# Altium schematic sheet Connectors.SchDoc
size A2; SheetNumber: 27; SheetTotal: 29
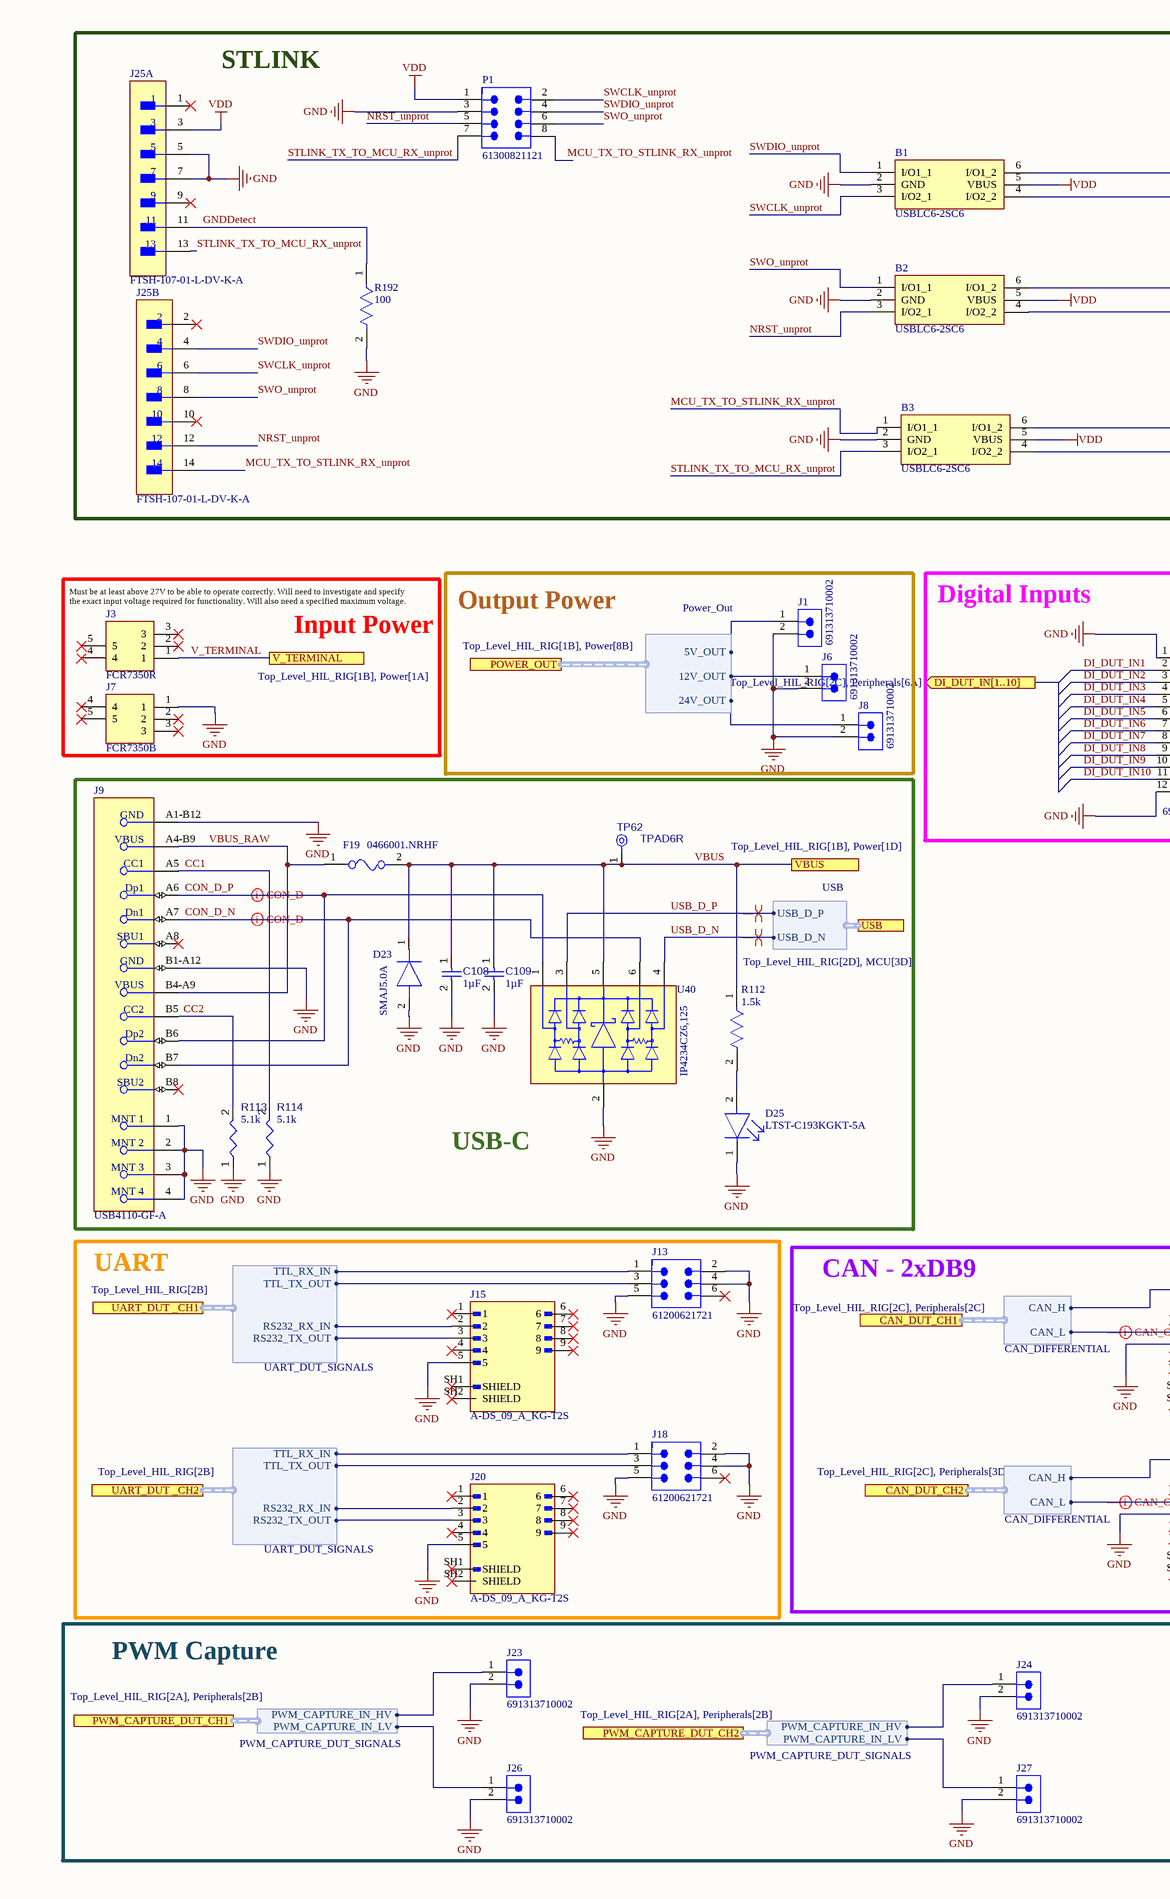
[diagram p0: Connectors.SchDoc, left]
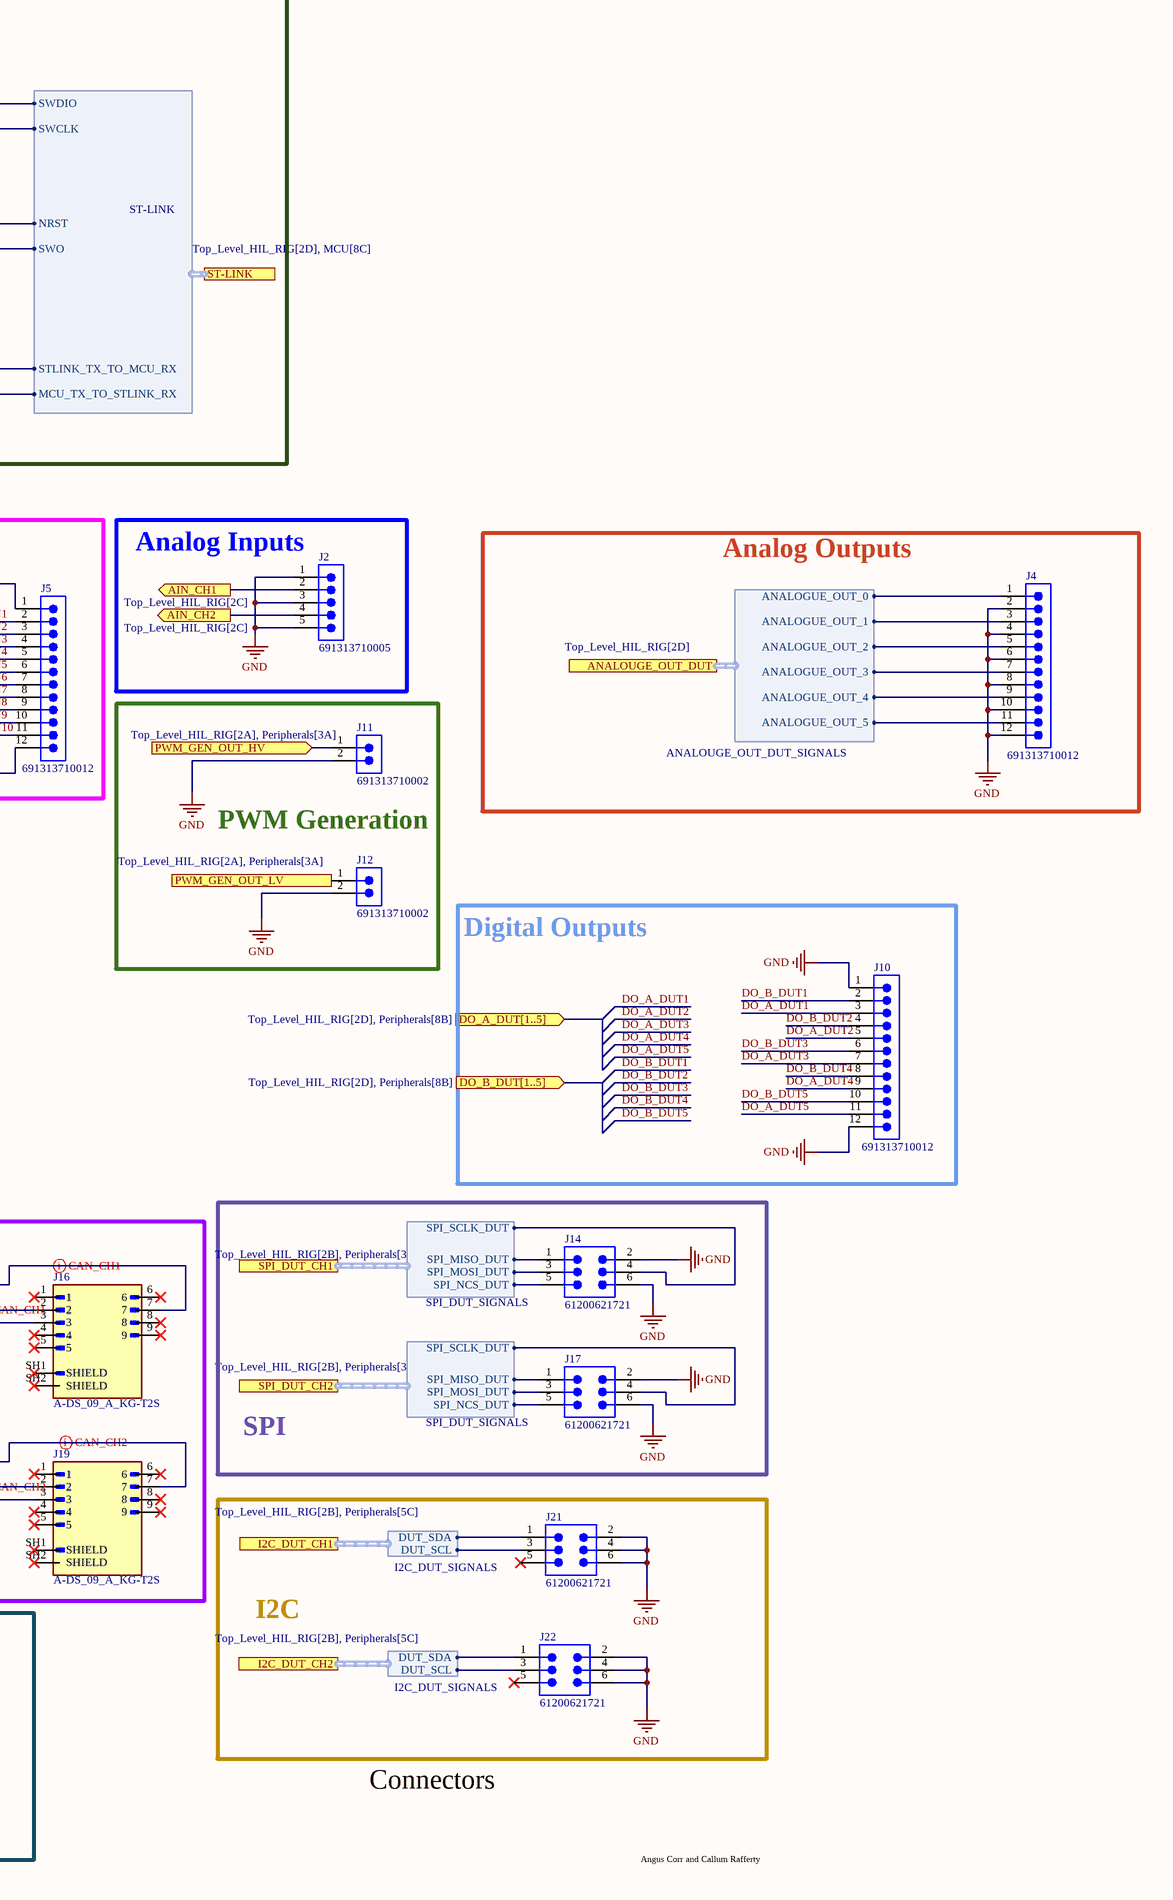
[diagram p1: Connectors.SchDoc, right]

## Parts
B1  USBLC6-2SC6  [SOT95P280X145-6N]
B2  USBLC6-2SC6  [SOT95P280X145-6N]
B3  USBLC6-2SC6  [SOT95P280X145-6N]
C108  value 1µF  [CAPC1608X90X40LL10T20]  (hidden comment: Capacitor 1 uF +/- 10% 25 V 0603)
C109  value 1µF  [CAPC1608X90X40LL10T20]  (hidden comment: Capacitor 1 uF +/- 10% 25 V 0603)
D23  SMAJ5.0A  [DIOM5026X229N]
D25  LTST-C193KGKT-5A  [FP-LTST-C193KGKT-5A-MFG]
F19  0466001.NRHF  [FP-0466-MFG]
J1  691313710002  [691313710002]
J2  691313710005  [691313710005]
J3  FCR7350R  [FCR7350R]
J4  691313710012  [691313710012]
J5  691313710012  [691313710012]
J6  691313710002  [691313710002]
J7  FCR7350B  [FCR7350B]
J8  691313710002  [691313710002]
J9  USB4110-GF-A  [FP-USB4110-GF-A-MFG]
J10  691313710012  [691313710012]
J11  691313710002  [691313710002]
J12  691313710002  [691313710002]
J13  61200621721  [61200621721]
J14  61200621721  [61200621721]
J15  A-DS_09_A_KG-T2S  [ASSMANN_A-DS_09_A_KG-T2S]
J16  A-DS_09_A_KG-T2S  [ASSMANN_A-DS_09_A_KG-T2S]
J17  61200621721  [61200621721]
J18  61200621721  [61200621721]
J19  A-DS_09_A_KG-T2S  [ASSMANN_A-DS_09_A_KG-T2S]
J20  A-DS_09_A_KG-T2S  [ASSMANN_A-DS_09_A_KG-T2S]
J21  61200621721  [61200621721]
J22  61200621721  [61200621721]
J23  691313710002  [691313710002]
J24  691313710002  [691313710002]
J25  FTSH-107-01-L-DV-K-A  [FP-FTSH-107-01-L-DV-K-A-MFG]  (parts A,B of 2)
J26  691313710002  [691313710002]
J27  691313710002  [691313710002]
P1  61300821121  [61300821121]
R112  value 1.5k  [FP-RT0603-IPC_C]  (hidden comment: RT0603BRD071K5L)
R113  value 5.1k  [FP-AC0603-IPC_C]  (hidden comment: AC0603FR-075K1L)
R114  value 5.1k  [FP-AC0603-IPC_C]  (hidden comment: AC0603FR-075K1L)
R192  value 100  [FP-RT0603-IPC_C]  (hidden comment: RT0603BRD07100RL)
TP62  TPAD6R  [TP06R]  (no BOM)
U40  IP4234CZ6,125  [Nexperia_SOT457_IPC_C]

## Blocks framed on the sheet
STLINK: B1-B3 J25 P1 R192
Input Power: J3 J7
Output Power: J1 J6 J8
Digital Inputs: J5
Analog Inputs: J2
Analog Outputs: J4
PWM Generation: J11 J12
USB-C: C108 C109 D23 D25 F19 J9 R112-R114 TP62 U40
Digital Outputs: J10
SPI: J14 J17
UART: J13 J15 J18 J20
CAN - 2xDB9: J16 J19
I2C: J21 J22
PWM Capture: J23 J24 J26 J27

## Ports
AIN_CH1 (out, see Top_Level_HIL_RIG[2C]), AIN_CH2 (out, see Top_Level_HIL_RIG[2C]), ANALOUGE_OUT_DUT (harness ANALOUGE_OUT_DUT_SIGNALS, see Top_Level_HIL_RIG[2D]), CAN_DUT_CH1 (harness CAN_DIFFERENTIAL, see Top_Level_HIL_RIG[2C], Peripherals[2C]), CAN_DUT_CH2 (harness CAN_DIFFERENTIAL, see Top_Level_HIL_RIG[2C], Peripherals[3D]), DI_DUT_IN[1..10] (out, see Top_Level_HIL_RIG[2C], Peripherals[6A]), DO_A_DUT[1..5] (in, see Top_Level_HIL_RIG[2D], Peripherals[8B]), DO_B_DUT[1..5] (in, see Top_Level_HIL_RIG[2D], Peripherals[8B]), I2C_DUT_CH1 (harness I2C_DUT_SIGNALS, see Top_Level_HIL_RIG[2B], Peripherals[5C]), I2C_DUT_CH2 (harness I2C_DUT_SIGNALS, see Top_Level_HIL_RIG[2B], Peripherals[5C]), POWER_OUT (harness Power_Out, see Top_Level_HIL_RIG[1B], Power[8B]), PWM_CAPTURE_DUT_CH1 (harness PWM_CAPTURE_DUT_SIGNALS, see Top_Level_HIL_RIG[2A], Peripherals[2B]), PWM_CAPTURE_DUT_CH2 (harness PWM_CAPTURE_DUT_SIGNALS, see Top_Level_HIL_RIG[2A], Peripherals[2B]), PWM_GEN_OUT_HV (in, see Top_Level_HIL_RIG[2A], Peripherals[3A]), PWM_GEN_OUT_LV (in, see Top_Level_HIL_RIG[2A], Peripherals[3A]), SPI_DUT_CH1 (harness SPI_DUT_SIGNALS, see Top_Level_HIL_RIG[2B], Peripherals[3C]), SPI_DUT_CH2 (harness SPI_DUT_SIGNALS, see Top_Level_HIL_RIG[2B], Peripherals[3C]), ST-LINK (harness ST-LINK, see Top_Level_HIL_RIG[2D], MCU[8C]), UART_DUT _CH1 (harness UART_DUT_SIGNALS, see Top_Level_HIL_RIG[2B]), UART_DUT _CH2 (harness UART_DUT_SIGNALS, see Top_Level_HIL_RIG[2B]), USB (harness USB, see Top_Level_HIL_RIG[2D], MCU[3D]), V_TERMINAL (see Top_Level_HIL_RIG[1B], Power[1A]), VBUS (see Top_Level_HIL_RIG[1B], Power[1D])

## Harnesses
USB: USB_D_P, USB_D_N
Power_Out: 24V_OUT, 12V_OUT, 5V_OUT
UART_DUT_SIGNALS: RS232_RX_IN, RS232_TX_OUT, TTL_RX_IN, TTL_TX_OUT
CAN_DIFFERENTIAL: CAN_H, CAN_L
PWM_CAPTURE_DUT_SIGNALS: PWM_CAPTURE_IN_HV, PWM_CAPTURE_IN_LV
I2C_DUT_SIGNALS: DUT_SCL, DUT_SDA
SPI_DUT_SIGNALS: SPI_MISO_DUT, SPI_MOSI_DUT, SPI_NCS_DUT, SPI_SCLK_DUT
ST-LINK: STLINK_TX_TO_MCU_RX, MCU_TX_TO_STLINK_RX, SWO, NRST, SWCLK, SWDIO
ANALOUGE_OUT_DUT_SIGNALS: ANALOGUE_OUT_0, ANALOGUE_OUT_1, ANALOGUE_OUT_2, ANALOGUE_OUT_3, ANALOGUE_OUT_4, ANALOGUE_OUT_5

## Nets
GND: B1.2(GND) B2.2(GND) B3.2(GND) C108.2 C109.2 D23.2(A) D25.1(C) J1.2 J2.1 J2.3 J2.5 J4.2 J4.4 J4.6 J4.8 J4.10 J4.12 J5.1 J5.12 J6.2 J7.1 J8.2 J9.1(MNT_1) J9.2(MNT_2) J9.3(MNT_3) J9.4(MNT_4) J9.A1-B12(GND) J9.B1-A12(GND) J10.1 J10.12 J11.2 J12.2 J13.2 J13.4 J13.5 J14.2 J14.6 J15.5 J16.3 J17.2 J17.6 J18.2 J18.4 J18.5 J19.3 J20.5 J21.2 J21.4 J21.6 J22.2 J22.4 J22.6 J23.2 J24.2 J25.5 J25.7 J26.2 J27.2 P1.3 R113.1 R114.1 R192.2 U40.2
VDD: B1.5(VBUS) B2.5(VBUS) B3.5(VBUS) J25.3 P1.1
AIN_CH1: J2.2 ; port AIN_CH1
AIN_CH2: J2.4 ; port AIN_CH2
CC1: J9.A5(CC1) R114.2
CC2: J9.B5(CC2) R113.2
CON_D_N: J9.A7(Dn1) J9.B7(Dn2) U40.6
CON_D_P: J9.A6(Dp1) J9.B6(Dp2) U40.1
DI_DUT_IN1: J5.2
DI_DUT_IN2: J5.3
DI_DUT_IN3: J5.4
DI_DUT_IN4: J5.5
DI_DUT_IN5: J5.6
DI_DUT_IN6: J5.7
DI_DUT_IN7: J5.8
DI_DUT_IN8: J5.9
DI_DUT_IN9: J5.10
DI_DUT_IN10: J5.11
DO_A_DUT1: J10.3
DO_A_DUT2: J10.5
DO_A_DUT3: J10.7
DO_A_DUT4: J10.9
DO_A_DUT5: J10.11
DO_B_DUT1: J10.2
DO_B_DUT2: J10.4
DO_B_DUT3: J10.6
DO_B_DUT4: J10.8
DO_B_DUT5: J10.10
GNDDetect: J25.11 R192.1
MCU_TX_TO_STLINK_RX_unprot: B3.1(I/O1_1) J25.14 P1.8
NRST_unprot: B2.3(I/O2_1) J25.12 P1.5
PWM_GEN_OUT_HV: J11.1 ; port PWM_GEN_OUT_HV
PWM_GEN_OUT_LV: J12.1 ; port PWM_GEN_OUT_LV
STLINK_TX_TO_MCU_RX_unprot: B3.3(I/O2_1) J25.13 P1.7
SWCLK_unprot: B1.3(I/O2_1) J25.6 P1.2
SWDIO_unprot: B1.1(I/O1_1) J25.4 P1.4
SWO_unprot: B2.1(I/O1_1) J25.8 P1.6
USB_D_N: U40.4 ; port USB.USB_D_N
USB_D_P: U40.3 ; port USB.USB_D_P
V_TERMINAL: J3.1 ; port V_TERMINAL
VBUS: C108.1 C109.1 D23.1(K) F19.2 R112.1 TP62.1(TP) U40.5 ; port VBUS
VBUS_RAW: F19.1 J9.A4-B9(VBUS) J9.B4-A9(VBUS)
NetB1_4: B1.4(I/O2_2) ; port ST-LINK.SWCLK
NetB1_6: B1.6(I/O1_2) ; port ST-LINK.SWDIO
NetB2_4: B2.4(I/O2_2) ; port ST-LINK.SWO
NetB2_6: B2.6(I/O1_2) ; port ST-LINK.NRST
NetB3_4: B3.4(I/O2_2) ; port ST-LINK.MCU_TX_TO_STLINK_RX
NetB3_6: B3.6(I/O1_2) ; port ST-LINK.STLINK_TX_TO_MCU_RX
NetD25_2: D25.2(A) R112.2
NetJ1_1: J1.1 ; port POWER_OUT.5V_OUT
NetJ4_1: J4.1 ; port ANALOUGE_OUT_DUT.ANALOGUE_OUT_0
NetJ4_3: J4.3 ; port ANALOUGE_OUT_DUT.ANALOGUE_OUT_1
NetJ4_5: J4.5 ; port ANALOUGE_OUT_DUT.ANALOGUE_OUT_2
NetJ4_7: J4.7 ; port ANALOUGE_OUT_DUT.ANALOGUE_OUT_3
NetJ4_9: J4.9 ; port ANALOUGE_OUT_DUT.ANALOGUE_OUT_4
NetJ4_11: J4.11 ; port ANALOUGE_OUT_DUT.ANALOGUE_OUT_5
NetJ6_1: J6.1 ; port POWER_OUT.12V_OUT
NetJ8_1: J8.1 ; port POWER_OUT.24V_OUT
NetJ13_1: J13.1 ; port UART_DUT _CH1.TTL_RX_IN
NetJ13_3: J13.3 ; port UART_DUT _CH1.TTL_TX_OUT
NetJ14_1: J14.1 ; port SPI_DUT_CH1.SPI_MISO_DUT
NetJ14_3: J14.3 ; port SPI_DUT_CH1.SPI_MOSI_DUT
NetJ14_4: J14.4 ; port SPI_DUT_CH1.SPI_SCLK_DUT
NetJ14_5: J14.5 ; port SPI_DUT_CH1.SPI_NCS_DUT
NetJ15_2: J15.2 ; port UART_DUT _CH1.RS232_RX_IN
NetJ15_3: J15.3 ; port UART_DUT _CH1.RS232_TX_OUT
NetJ16_2: J16.2 ; port CAN_DUT_CH1.CAN_L
NetJ16_7: J16.7 ; port CAN_DUT_CH1.CAN_H
NetJ17_1: J17.1 ; port SPI_DUT_CH2.SPI_MISO_DUT
NetJ17_3: J17.3 ; port SPI_DUT_CH2.SPI_MOSI_DUT
NetJ17_4: J17.4 ; port SPI_DUT_CH2.SPI_SCLK_DUT
NetJ17_5: J17.5 ; port SPI_DUT_CH2.SPI_NCS_DUT
NetJ18_1: J18.1 ; port UART_DUT _CH2.TTL_RX_IN
NetJ18_3: J18.3 ; port UART_DUT _CH2.TTL_TX_OUT
NetJ19_2: J19.2 ; port CAN_DUT_CH2.CAN_L
NetJ19_7: J19.7 ; port CAN_DUT_CH2.CAN_H
NetJ20_2: J20.2 ; port UART_DUT _CH2.RS232_RX_IN
NetJ20_3: J20.3 ; port UART_DUT _CH2.RS232_TX_OUT
NetJ21_1: J21.1 ; port I2C_DUT_CH1.DUT_SDA
NetJ21_3: J21.3 ; port I2C_DUT_CH1.DUT_SCL
NetJ22_1: J22.1 ; port I2C_DUT_CH2.DUT_SDA
NetJ22_3: J22.3 ; port I2C_DUT_CH2.DUT_SCL
NetJ23_1: J23.1 ; port PWM_CAPTURE_DUT_CH1.PWM_CAPTURE_IN_HV
NetJ24_1: J24.1 ; port PWM_CAPTURE_DUT_CH2.PWM_CAPTURE_IN_HV
NetJ26_1: J26.1 ; port PWM_CAPTURE_DUT_CH1.PWM_CAPTURE_IN_LV
NetJ27_1: J27.1 ; port PWM_CAPTURE_DUT_CH2.PWM_CAPTURE_IN_LV

Not connected (* = marked no-connect by the designer): J3 2* 3* 4* 5*; J7 2* 3* 4* 5*; J9 A8(SBU1)* B8(SBU2)*; J13 6*; J15 1* 4* 6* 7* 8* 9* SH1(SHIELD)* SH2(SHIELD)*; J16 1* 4* 5* 6* 8* 9* SH1(SHIELD)* SH2(SHIELD)*; J18 6*; J19 1* 4* 5* 6* 8* 9* SH1(SHIELD)* SH2(SHIELD)*; J20 1* 4* 6* 7* 8* 9* SH1(SHIELD)* SH2(SHIELD)*; J21 5*; J22 5*; J25 1* 2* 9* 10*

## Layout directives
differential pair; differential pair class USB_DIFF_PAIR: CON_D_P
differential pair: CON_D_N, NetJ16_7, NetJ19_7, USB_D_N, USB_D_P
differential pair; differential pair class CAN_DIFF_PAIR: NetJ16_2, NetJ19_2

## Notes on the sheet
- (near J3) Must be at least above 27V to be able to operate correctly. Will need to investigate and specify the exact input voltage required for functionality. Will also need a specified maximum voltage.
- Connectors
- Angus Corr and Callum Rafferty

## Library data of the parts
B1-B3 = CMP-004-00066-1: TVS Diode Array Uni-Directional USBLC6-2SC6 17V, SOT-23 6-Pin; Manufacturer_Name: STMicroelectronics; Geometry.Height: 1.45mm; Arrow Price/Stock: https://www.arrow.com/en/products/usblc6-2sc6/stmicroelectronics.html?utm_currency=USD&region=nac; Manufacturer_Part_Number: USBLC6-2SC6; Arrow Part Number: USBLC6-2SC6; Datasheet Link: https://www.st.com/resource/en/datasheet/usblc6-2.pdf; Mouser Part Number: 511-USBLC6-2SC6; Source: USBLC6-2SC6.SchLib; Design Item ID: USBLC6-2SC6; Mouser Price/Stock: https://www.mouser.co.uk/ProductDetail/STMicroelectronics/USBLC6-2SC6?qs=po45yt2pPpu%2FhNIlwQdTlg%3D%3D
C108 C109 = CMP-001-00005-6: Chip Capacitor, 1 uF, +/- 10%, 25 V, 0603 (1608 Metric); Capacitor Type: Ceramic; Voltage Rating: 25V; Pins: 2; Mounting Technology: SM; RoHS Compliant: True; Max Operating Temperature: 125°C; Case/Package: 0603; Min Operating Temperature: -55°C; Tolerance: 10%
D23 = CMP-004-00080-1: BOURNS - SMAJ5.0A - TVS Diode; Manufacturer_Name: Bourns; Source: MAX17643ATC+.SchLib; Datasheet Link: https://detail.tmall.com/item.htm?id=548354020241&ali_refid=a3_430583_1006:1109983619:N:3Uw9kZ3UMDT/QL57nh1fXA==:ab063b49c94624768a940a913313feb0&ali_trackid=1_ab063b49c94624768a940a913313feb0&spm=a230r.1.14.1; Arrow Price/Stock: https://www.arrow.com/en/products/smaj5-0a_21/bourns.html?utm_currency=USD&region=nac; Mouser Price/Stock: https://www.mouser.co.uk/ProductDetail/Bourns/SMAJ5.0A?qs=A3H9pljuJ8RbLIvzFxDfUA%3D%3D; Height: 2.29mm; Arrow Part Number: SMAJ5.0A; Manufacturer_Part_Number: SMAJ5.0A; Mouser Part Number: 652-SMAJ5.0A; Design Item ID: SMAJ5.0A
D25 = CMP-007-00038-1: LED yellow green 0603 wavelength 567.5~576.5nm light intensity 4.5~28mcd Front Mounting; Luminous Intensity: 16.25mcd; Viewing Angle: 130°; Number of Circuits: 1; Power Dissipation: 50mW; Peak Wavelength: 574nm; Illumination Color: Green, Yellow; Lens Color: Clear, Colorless; Lens Style: Clear, Colorless, Diffused, Rectangular; Forward Voltage: 1.9V; Power Rating: 75mW; Reverse Voltage: 5V; Wavelength: 571nm; Shape: Rectangular; Lens Transparency: Clear; Test Current: 5mA; Forward Current: 30mA; Width: 800µm; Manufacturer Package Identifier: LTST-C193KGKT-5A; Dominant Wavelength: 576.5nm; Export Control Classification Number (ECCN) Code: EAR99; Color: Green; Lead Free: Lead Free; Introduction Date: 2007-03-15; RoHS: Compliant; Number of Elements: 1; Height: 350µm; Schedule B: 8541402000, 8541402000; Country of Origin: Mainland China, Thailand; Case Code (Imperial): 0603; Length: 1.6mm; Lifecycle Status: Production; China RoHS: Compliant; Min Operating Temperature: -55°C; Terminal Pitch: 1.5mm; Number of LEDs: 1; Number of Terminals: 2; Pins: 2; Case Code (Metric): 1608; Max Operating Temperature: 85°C; Harmonized Tariff Schedule (HTS) Code: 8541.40.20.00; Depth: 800µm; Mounting Technology: Surface Mount; Case/Package: 0603; REACH SVHC: Yes; Radiation Hardening: No
F19 = CMP-005-00016-1: Electric Fuse, Fast Blow, 1A, 63VAC, 63VDC, 50A (IR), Supplemental, Surface Mount, 1206; Case/Package: 1206; Min Operating Temperature: -55°C; Max Operating Temperature: 90°C; Current Rating: 1A; Mounting Technology: Surface Mount
J1 J6 J8 J11 J12 J23 J24 J26 J27 = CMP-002-00093-1: WR-TBL Terminal block - PCB Header - THT; Manufacturer Lifecycle Status: ACTIVE; YEOL: 1 = Estimated lifetime > 10 years; Number of Levels: 1; Number of Contacts: 2; Pitch: 5mm; Connector Type: PCB, Terminal Block; Current Rating: 20A; Voltage: 300V; Gender: Male; Height: 8.7mm; Width: 12mm; Min Operating Temperature: -40°C; Pins: 2; Length: 11.4mm; Contact Material: Tin; Lifecycle Status: Production; RoHS: Compliant; Contact Plating: Tin; Lead Pitch: 5mm; Mounting Technology: Through Hole; Termination: Solder; REACH SVHC: Unknown; Color: Green; Number of Rows: 1; Current: 20A; Max Operating Temperature: 105°C; Voltage Rating: 300V; Number of Positions Per Level: 2; Packaging: Box
J2 = CMP-002-00094-1: Terminal Block, 5.00MM Pitch, Close Horizontal Pcb Header, 300VAC, 5 Pins; Manufacturer Lifecycle Status: ACTIVE; Pitch: 5mm; Connector Type: PCB, Terminal Block; YEOL: 1 = Estimated lifetime > 10 years; Number of Levels: 1; Number of Positions Per Level: 5; Current: 20A; Voltage: 300V; Gender: Male; REACH SVHC: No; Color: Green; Termination: Solder; Mounting Technology: Through Hole; Lifecycle Status: Production; Width: 27mm; Min Operating Temperature: -40°C; Max Operating Temperature: 105°C; Lead Pitch: 5mm; Number of Rows: 1; Packaging: Box; Height: 12mm; RoHS: Compliant; Number of Contacts: 5; Contact Plating: Tin; Contact Material: Brass; Pins: 5; Length: 26.4mm; Contact Gender: Male
J3 = CMP-002-00102-1: CLIFF ELECTRONIC COMPONENTS - FCR7350R - SOCKET; Manufacturer_Name: CLIFF ELECTRONIC COMPONENTS; Source: MAX17643ATC+.SchLib; Manufacturer_Part_Number: FCR7350R; Height: 11.5mm; Datasheet Link: http://www.cliffuk.co.uk/products/testleads/sockets/S16NPC.pdf; Design Item ID: FCR7350R
J4 J5 J10 = CMP-002-00096-1: Terminal Block, R/A Header, 12Pos, Th Rohs Compliant: Yes; Manufacturer Lifecycle Status: ACTIVE; YEOL: 1 = Estimated lifetime > 10 years; Pitch: 5mm; Lifecycle Status: Production; RoHS: Compliant; Pins: 12; Min Operating Temperature: -40°C; Max Operating Temperature: 105°C; Length: 61.4mm; Packaging: Box; Contact Plating: Tin
J7 = CMP-002-00101-1: Banana Jack Connector Standard Banana Solder Black Female  Through Hole; Manufacturer_Name: CLIFF ELECTRONIC COMPONENTS; Manufacturer_Part_Number: FCR7350B; Source: MAX17643ATC+.SchLib; Datasheet Link: https://www.cliffuk.co.uk/products/testleads/sockets/S16NPC.pdf; Design Item ID: FCR7350B; Height: 12.3mm
J9 = CMP-002-00074-1: USB Connector, 16 Contact(s), Male, Right Angle, Surface Mount Terminal, Locking, Receptacle; Number of Ports: 1; USB Standard: USB 2.0; Number of Contacts: 16; Contact Resistance: 50mΩ; Voltage Rating: 20V; Insulation Resistance: 100MΩ; Dielectric Material: Polyethylene; Min Operating Temperature: -40°C; Country of Origin: Mainland China; Max Operating Temperature: 85°C; Height: 3.46mm; REACH SVHC: Yes; RoHS: Compliant; Contact Gender: Male; Contact Material: Gold, Nickel; Orientation: Horizontal; Pins: 16; Lifecycle Status: Production; Harmonized Tariff Schedule (HTS) Code: 8536.69.40.30; Shell Finish: Nickel; Gender: Receptacle; China RoHS: Compliant; Shell Material: Stainless Steel; Number of Rows: 1; Export Control Classification Number (ECCN) Code: EAR99; Terminal Pitch: 500µm; Introduction Date: 2021-04-15
J13 J14 J17 J18 J21 J22 = CMP-002-00098-1: Wr-bhd; 2.54MM Pitch 6 Way 2 Row Shrouded Right Angle Pcb Header, Surface Mount; Manufacturer Lifecycle Status: ACTIVE; Operating Supply Voltage: 250V; Gender: Male; Insulation Resistance: 1GΩ; Contact Resistance: 20mΩ; Connector Type: Male Pin; Current Rating: 3A; YEOL: 1 = Estimated lifetime > 10 years; Number of Positions: 6; Number of Rows: 2; Length: 15.28mm; RoHS: Compliant; Max Operating Temperature: 105°C; Contact Material: Copper; Lead Pitch: 2.54mm; Row Spacing: 2.54mm; Mounting Technology: Through Hole; Contact Plating: Gold; Lifecycle Status: Production; Insulation Material: PBT; Color: Black; Pitch: 2.54mm; Pins: 6; Min Operating Temperature: -40°C; Termination: Solder; Number of Contacts: 6
J15 J16 J19 J20 = CMP-011-000000-1: 9 Position D-Sub Plug, Male Pins Connector; MF: Assmann WSW; MP: A-DS 09 A/KG-T2S; Component Type: Standard; Design Item ID: A-DS_09_A_KG-T2S; SnapEDA_Link: https://www.snapeda.com/parts/A-DS%2009%20A/KG-T2S/Assmann+Electronics/view-part/?ref=snap; Check_prices: https://www.snapeda.com/parts/A-DS%2009%20A/KG-T2S/Assmann+Electronics/view-part/?ref=eda; Source: A-DS_09_A_KG-T2S.SchLib; Package: None; Pin Count: 11; Value: *
J25 = CMP-002-00097-1: Conn Unshrouded Header HDR 14 POS 1.27mm Solder ST Top Entry SMD TIGER CLAW™ Tube; Manufacturer Lifecycle Status: PRODUCTION; Current Rating: 3.4A; Gender: Male; Number of Contacts: 14; Lifecycle Status: Production; RoHS: Compliant; Lead Free: Lead Free; Termination: Solder; Contact Material: Gold, Nickel; Schedule B: 8536694040; Max Operating Temperature: 125°C; Contact Plating: Gold; Number of Rows: 2; Min Operating Temperature: -55°C; Pitch: 1.27mm; Pins: 14; Orientation: Vertical; Height: 6.38mm
P1 = CMP-002-00099-1: Conn Unshrouded Header HDR 8 POS 2.54mm Solder ST Top Entry Thru-Hole Bag; Manufacturer Lifecycle Status: ACTIVE; Number of Contacts: 8; Connector Type: Male Pin; Insulation Resistance: 1GΩ; Operating Supply Voltage: 250V; Gender: Male; Contact Resistance: 20mΩ; Current Rating: 3A; YEOL: 1 = Estimated lifetime > 10 years; Lead Free: Lead Free; Lifecycle Status: Production; Contact Mating Length: 5.9944mm; Color: Black; Max Operating Temperature: 105°C; Length: 10.16mm; Pins: 8; Termination: Solder; Packaging: Bulk; Height: 8.89mm; Row Spacing: 2.54mm; Pitch: 2.54mm; RoHS: Compliant; Lead Pitch: 2.54mm; Contact Plating: Gold; Number of Rows: 2; Voltage Rating: 250V; Number of Positions: 8; Contact Material: Gold; Mounting Technology: Through Hole; Min Operating Temperature: -40°C; Orientation: Vertical
R112 = CMP-009-00351-1: Res Thin Film 0603 1.5K Ohm 0.1% 1/10W ±25ppm/°C Molded SMD SMD Paper T/R; Voltage Rating: 75V; Max Power Dissipation: 100mW; Voltage Rating (DC): 50V; Mounting Technology: Surface Mount; Max Operating Temperature: 155°C; Depth: 800µm; Tolerance: 0.1%; Width: 800µm; Contact Plating: Tin; REACH SVHC: Yes; Working Voltage: 75V; Case/Package: 0603; Number of Terminals: 2; Termination: SMD/SMT; Military Standard: Not; Height: 450µm; Lifecycle Status: Production; Features: Moisture Resistant; Composition: Thin Film; Number of Terminations: 2; Lead Free: Lead Free; Radiation Hardening: No; Temperature Coefficient: 25ppm/°C; Length: 1.6mm; RoHS: Compliant; Min Operating Temperature: -55°C; Power Rating: 100mW; China RoHS: Non-Compliant; Schedule B: 8533210045, 8533210045; Case Code (Imperial): 0603; Country of Origin: Mainland China, Taiwan; Export Control Classification Number (ECCN) Code: EAR99; Harmonized Tariff Schedule (HTS) Code: 8533.21.00.30; Introduction Date: 2008-06-09
R113 R114 = CMP-009-00333-1: Res Thick Film 0603 5.1K Ohm 1% 0.1W(1/10W) ±100ppm/C Pad SMD Automotive T/R; Voltage Rating: 75V; Max Power Dissipation: 100mW; Temperature Coefficient: 100ppm/°C; Max Operating Temperature: 155°C; Case/Package: 0603; Min Operating Temperature: -55°C; Mounting Technology: Surface Mount; Tolerance: 1%; Case Code (Imperial): 0603; Case Code (Metric): 1608; China RoHS: Non-Compliant; Composition: Thick Film; Features: Automotive AEC-Q200, Moisture Resistant; Height: 450µm; Length: 1.6mm; Lifecycle Status: Production; Number of Terminals: 2; Number of Terminations: 2; Packaging: Tape & Reel; Power Rating: 100mW; Ratings: AEC-Q200; REACH SVHC: Yes; RoHS: Compliant; Schedule B: 8533210045, 8533210045; Termination: SMD/SMT; Weight: 2.012816mg; Width: 800µm; Working Voltage: 75V
R192 = CMP-009-00335-1: 100mW Thin Film Resistor 75V ±25ppm/℃ ±0.1% 100Ω 0603 Chip Resistor - Surface Mount ROHS; Temperature Coefficient: 25ppm/°C; Height: 450µm; Min Operating Temperature: -55°C; China RoHS: Non-Compliant; Power Rating: 100mW; Composition: Thin Film; Number of Terminals: 2; REACH SVHC: Yes; Tolerance: 0.1%; Length: 1.6mm; Mounting Technology: Surface Mount; Working Voltage: 75V; Lifecycle Status: Production; Voltage Rating: 75V; RoHS: Compliant; Width: 800µm; Max Operating Temperature: 155°C; Case/Package: 0603; Case Code (Imperial): 0603; Country of Origin: Mainland China, Taiwan; Depth: 800µm; Export Control Classification Number (ECCN) Code: EAR99; Features: Moisture Resistant; Harmonized Tariff Schedule (HTS) Code: 8533.21.00.30; Introduction Date: 2008-06-09; Lead Free: Lead Free; Max Power Dissipation: 100mW; Military Standard: Not; Number of Terminations: 2; Schedule B: 8533210045, 8533210045; Termination: SMD/SMT; Voltage Rating (DC): 75V; Weight: 2.012816mg
TP62 = CMP-00028-00002-2: 0.6mm round; Pins: 1
U40 = CMP-004-00048-1: IP4234CZ6 Series 4 Channel Single USB 2.0 ESD Protection Surface Mount - TSOP-6; Max Operating Temperature: 85°C; Mounting Technology: Surface Mount; Case/Package: TSOP; Pins: 6; Min Operating Temperature: -40°C